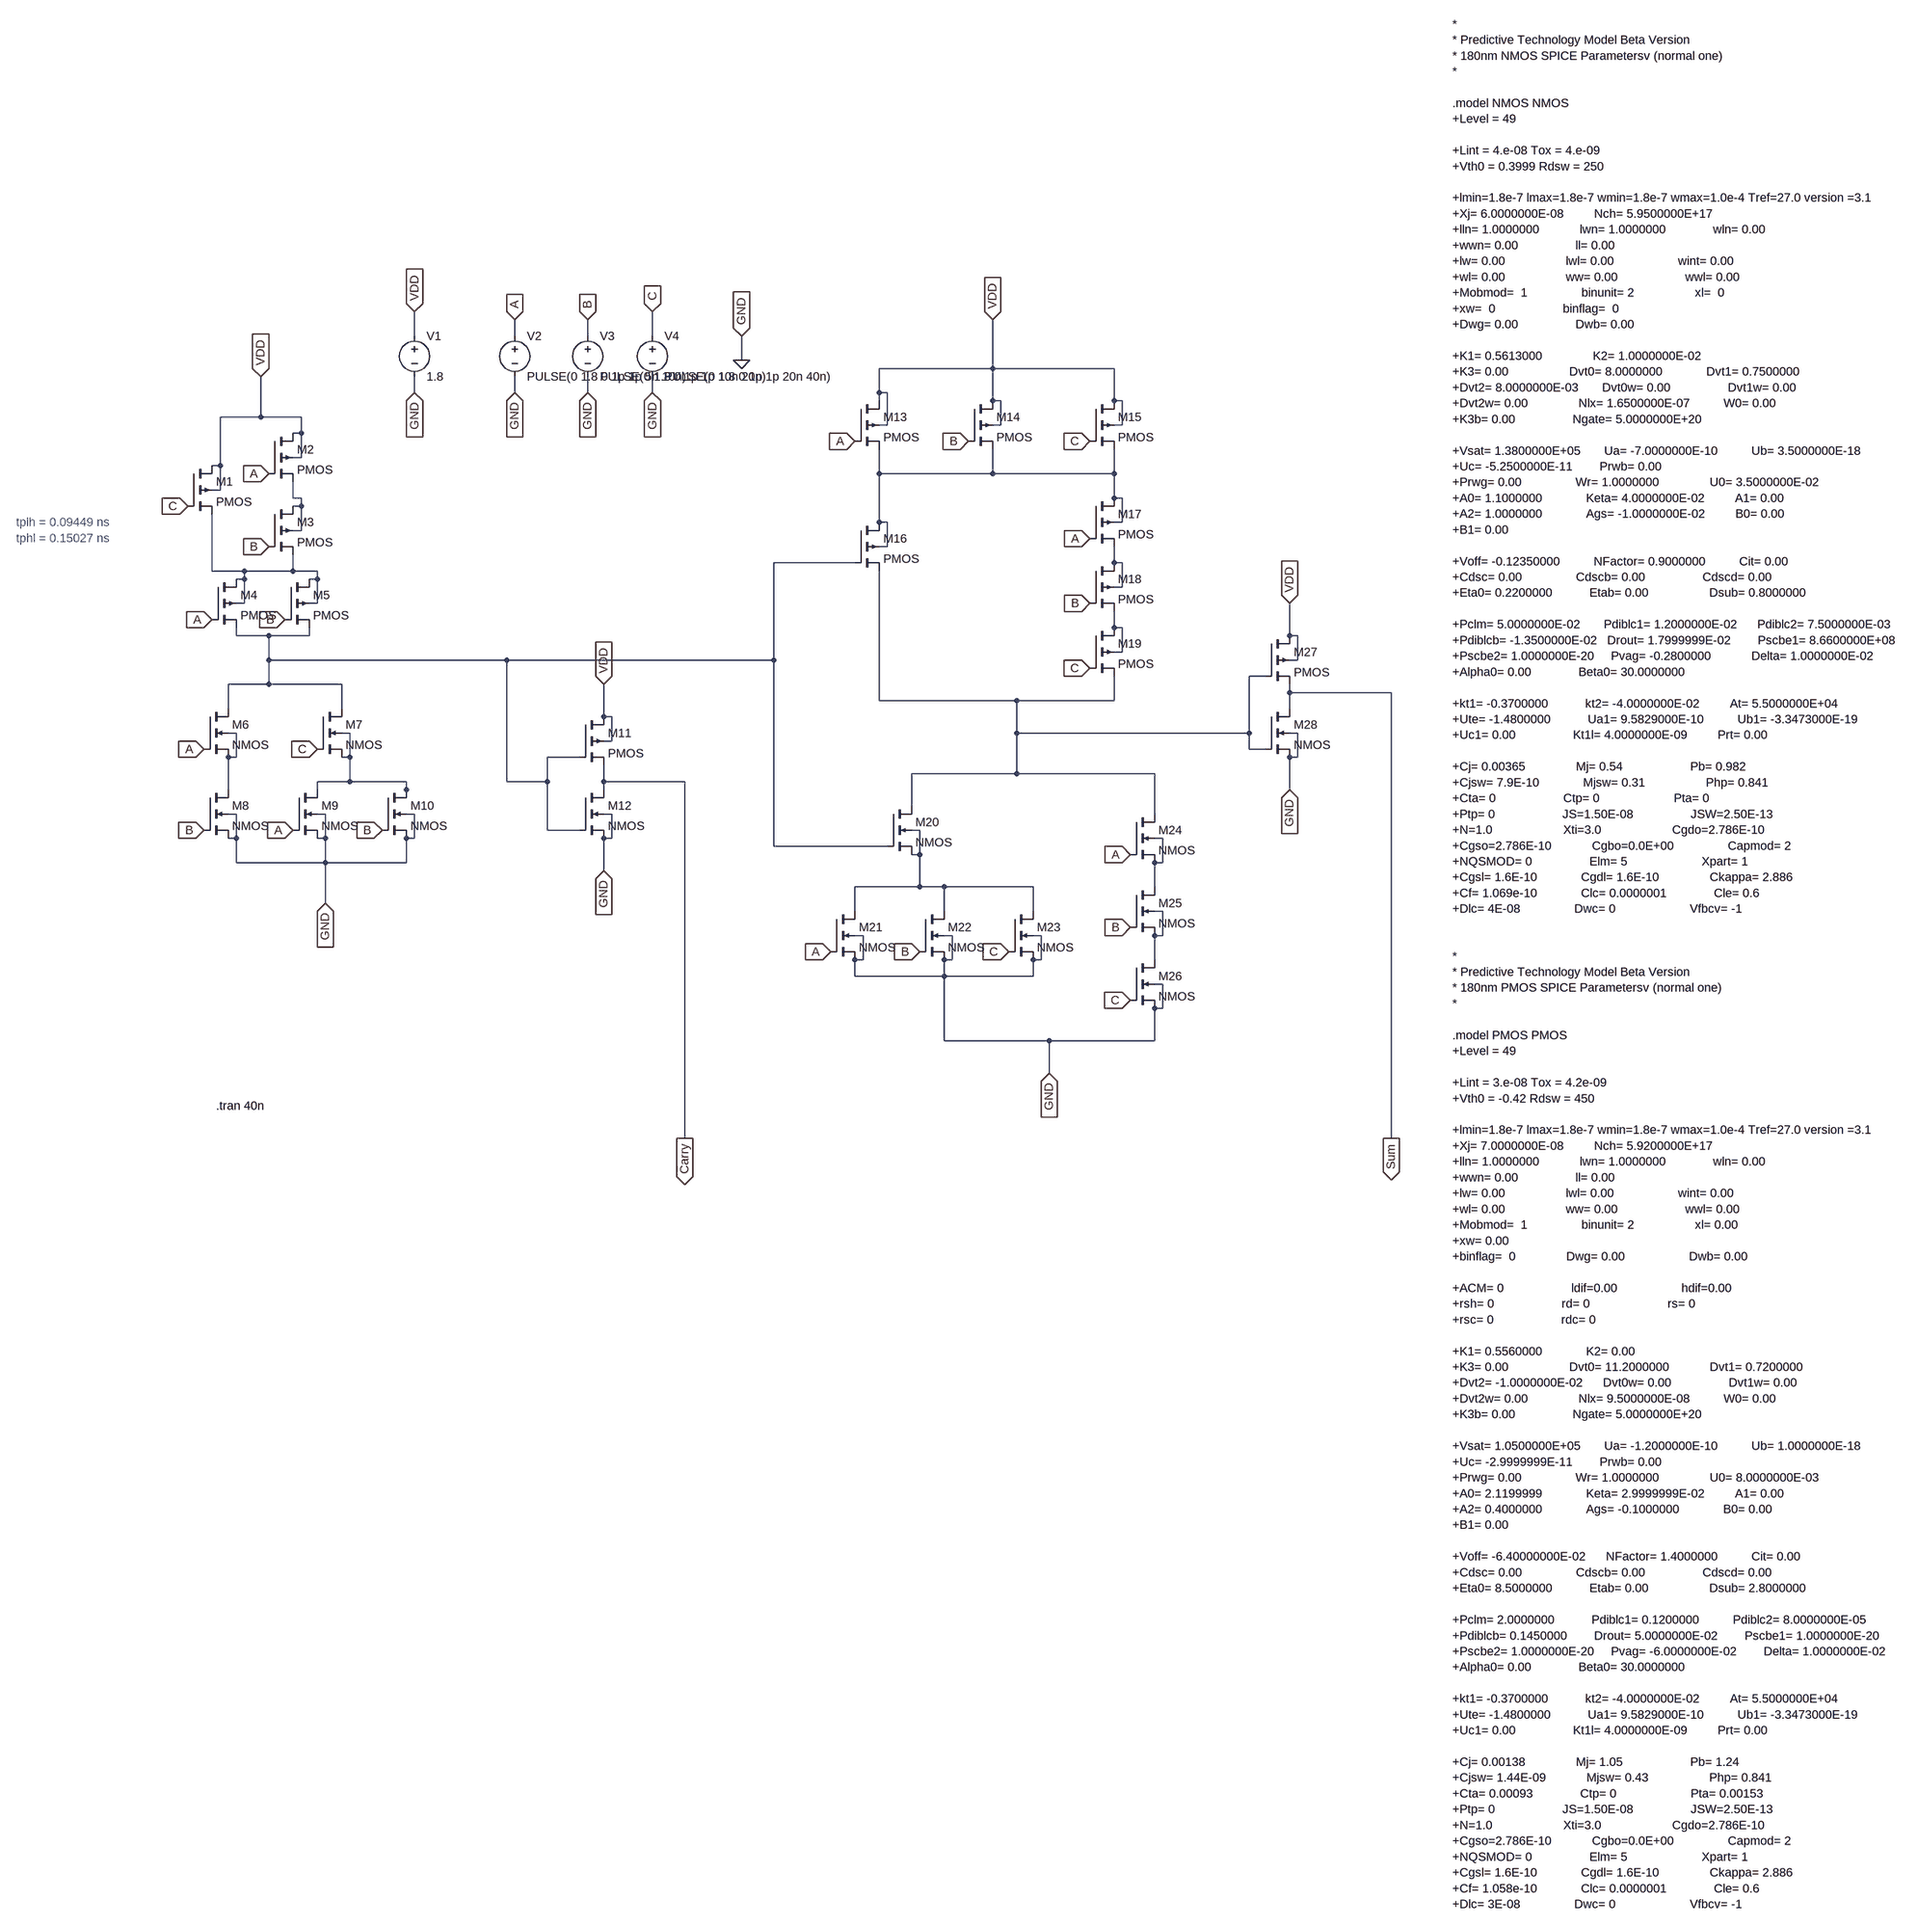
[diagram p0: schematic AssignmentCMOS.asc]
AssignmentCMOS.asc, the LTspice schematic file:
Version 4
SHEET 1 3944 2892
WIRE 512 -176 512 -224
WIRE 720 -176 720 -208
WIRE 864 -176 864 -208
WIRE 992 -176 992 -224
WIRE 1168 -128 1168 -176
WIRE 1664 -112 1664 -208
WIRE 1664 -112 1440 -112
WIRE 1904 -112 1664 -112
WIRE 512 -64 512 -96
WIRE 720 -64 720 -96
WIRE 864 -64 864 -96
WIRE 992 -64 992 -96
WIRE 1440 -64 1440 -112
WIRE 1456 -64 1440 -64
WIRE 1440 -48 1440 -64
WIRE 1664 -48 1664 -112
WIRE 1680 -48 1664 -48
WIRE 1904 -48 1904 -112
WIRE 1920 -48 1904 -48
WIRE 208 -16 208 -96
WIRE 208 -16 128 -16
WIRE 288 -16 208 -16
WIRE 1456 0 1456 -64
WIRE 1456 0 1440 0
WIRE 1680 0 1680 -48
WIRE 1680 0 1664 0
WIRE 1920 0 1920 -48
WIRE 1920 0 1904 0
WIRE 288 16 288 -16
WIRE 288 16 272 16
WIRE 288 64 288 16
WIRE 288 64 272 64
WIRE 128 80 128 -16
WIRE 128 80 112 80
WIRE 1440 96 1440 48
WIRE 1664 96 1664 48
WIRE 1664 96 1440 96
WIRE 1904 96 1904 48
WIRE 1904 96 1664 96
WIRE 128 128 128 80
WIRE 128 128 112 128
WIRE 272 144 272 112
WIRE 288 144 272 144
WIRE 1904 144 1904 96
WIRE 1920 144 1904 144
WIRE 288 160 288 144
WIRE 288 160 272 160
WIRE 1440 192 1440 96
WIRE 1456 192 1440 192
WIRE 1920 192 1920 144
WIRE 1920 192 1904 192
WIRE 288 208 288 160
WIRE 288 208 272 208
WIRE 1456 240 1456 192
WIRE 1456 240 1440 240
WIRE 1392 272 1232 272
WIRE 1904 272 1904 240
WIRE 1920 272 1904 272
WIRE 112 288 112 176
WIRE 176 288 112 288
WIRE 272 288 272 256
WIRE 272 288 176 288
WIRE 320 288 272 288
WIRE 176 304 176 288
WIRE 176 304 160 304
WIRE 320 304 320 288
WIRE 320 304 304 304
WIRE 1920 320 1920 272
WIRE 1920 320 1904 320
WIRE 176 352 176 304
WIRE 176 352 160 352
WIRE 320 352 320 304
WIRE 320 352 304 352
WIRE 1904 400 1904 368
WIRE 1920 400 1904 400
WIRE 160 416 160 400
WIRE 224 416 160 416
WIRE 304 416 304 400
WIRE 304 416 224 416
WIRE 2496 416 2496 352
WIRE 2512 416 2496 416
WIRE 1920 448 1920 400
WIRE 1920 448 1904 448
WIRE 224 464 224 416
WIRE 704 464 224 464
WIRE 1232 464 1232 272
WIRE 1232 464 704 464
WIRE 2512 464 2512 416
WIRE 2512 464 2496 464
WIRE 2448 496 2416 496
WIRE 224 512 224 464
WIRE 224 512 144 512
WIRE 368 512 224 512
WIRE 2496 528 2496 512
WIRE 2800 528 2496 528
WIRE 1440 544 1440 288
WIRE 1712 544 1440 544
WIRE 1904 544 1904 496
WIRE 1904 544 1712 544
WIRE 144 560 144 512
WIRE 368 560 368 512
WIRE 2496 560 2496 528
WIRE 896 576 896 512
WIRE 912 576 896 576
WIRE 160 608 144 608
WIRE 384 608 368 608
WIRE 1712 608 1712 544
WIRE 2416 608 2416 496
WIRE 2416 608 1712 608
WIRE 2512 608 2496 608
WIRE 912 624 912 576
WIRE 912 624 896 624
WIRE 2416 640 2416 608
WIRE 2448 640 2416 640
WIRE 160 656 160 608
WIRE 160 656 144 656
WIRE 384 656 384 608
WIRE 384 656 368 656
WIRE 848 656 784 656
WIRE 2512 656 2512 608
WIRE 2512 656 2496 656
WIRE 1712 688 1712 608
WIRE 1712 688 1504 688
WIRE 1984 688 1712 688
WIRE 384 704 384 656
WIRE 384 704 320 704
WIRE 496 704 384 704
WIRE 704 704 704 464
WIRE 784 704 784 656
WIRE 784 704 704 704
WIRE 896 704 896 672
WIRE 1056 704 896 704
WIRE 144 720 144 656
WIRE 320 720 320 704
WIRE 496 720 496 704
WIRE 896 720 896 704
WIRE 2496 720 2496 656
WIRE 496 736 496 720
WIRE 1504 752 1504 688
WIRE 160 768 144 768
WIRE 336 768 320 768
WIRE 512 768 496 768
WIRE 912 768 896 768
WIRE 1984 768 1984 688
WIRE 784 800 784 704
WIRE 848 800 784 800
WIRE 1520 800 1504 800
WIRE 160 816 160 768
WIRE 160 816 144 816
WIRE 336 816 336 768
WIRE 336 816 320 816
WIRE 512 816 512 768
WIRE 512 816 496 816
WIRE 912 816 912 768
WIRE 912 816 896 816
WIRE 2000 816 1984 816
WIRE 1232 832 1232 464
WIRE 1456 832 1232 832
WIRE 1520 848 1520 800
WIRE 1520 848 1504 848
WIRE 160 864 160 816
WIRE 336 864 336 816
WIRE 336 864 160 864
WIRE 496 864 496 816
WIRE 496 864 336 864
WIRE 2000 864 2000 816
WIRE 2000 864 1984 864
WIRE 896 880 896 816
WIRE 1520 912 1520 848
WIRE 1520 912 1392 912
WIRE 1568 912 1520 912
WIRE 1744 912 1568 912
WIRE 1984 912 1984 864
WIRE 336 944 336 864
WIRE 1392 960 1392 912
WIRE 1568 960 1568 912
WIRE 1744 960 1744 912
WIRE 2000 960 1984 960
WIRE 1408 1008 1392 1008
WIRE 1584 1008 1568 1008
WIRE 1760 1008 1744 1008
WIRE 2000 1008 2000 960
WIRE 2000 1008 1984 1008
WIRE 1408 1056 1408 1008
WIRE 1408 1056 1392 1056
WIRE 1584 1056 1584 1008
WIRE 1584 1056 1568 1056
WIRE 1760 1056 1760 1008
WIRE 1760 1056 1744 1056
WIRE 1984 1056 1984 1008
WIRE 1392 1088 1392 1056
WIRE 1568 1088 1568 1056
WIRE 1568 1088 1392 1088
WIRE 1744 1088 1744 1056
WIRE 1744 1088 1568 1088
WIRE 2000 1104 1984 1104
WIRE 2000 1152 2000 1104
WIRE 2000 1152 1984 1152
WIRE 1568 1216 1568 1088
WIRE 1776 1216 1568 1216
WIRE 1984 1216 1984 1152
WIRE 1984 1216 1776 1216
WIRE 1776 1280 1776 1216
WIRE 1056 1408 1056 704
WIRE 2800 1408 2800 528
FLAG 1168 -128 0
FLAG 1168 -176 GND
IOPIN 1168 -176 In
FLAG 992 -64 GND
IOPIN 992 -64 In
FLAG 720 -64 GND
IOPIN 720 -64 In
FLAG 512 -64 GND
IOPIN 512 -64 In
FLAG 864 -64 GND
IOPIN 864 -64 In
FLAG 512 -224 VDD
IOPIN 512 -224 In
FLAG 720 -208 A
IOPIN 720 -208 In
FLAG 864 -208 B
IOPIN 864 -208 In
FLAG 992 -224 C
IOPIN 992 -224 In
FLAG 208 -96 VDD
IOPIN 208 -96 In
FLAG 1664 -208 VDD
IOPIN 1664 -208 In
FLAG 896 512 VDD
IOPIN 896 512 In
FLAG 2496 352 VDD
IOPIN 2496 352 In
FLAG 336 944 GND
IOPIN 336 944 In
FLAG 896 880 GND
IOPIN 896 880 In
FLAG 1776 1280 GND
IOPIN 1776 1280 In
FLAG 2496 720 GND
IOPIN 2496 720 In
FLAG 2800 1408 Sum
IOPIN 2800 1408 Out
FLAG 1056 1408 Carry
IOPIN 1056 1408 Out
FLAG 64 160 C
IOPIN 64 160 In
FLAG 320 640 C
IOPIN 320 640 In
FLAG 1856 32 C
IOPIN 1856 32 In
FLAG 1856 480 C
IOPIN 1856 480 In
FLAG 1696 1040 C
IOPIN 1696 1040 In
FLAG 1936 1136 C
IOPIN 1936 1136 In
FLAG 224 96 A
IOPIN 224 96 In
FLAG 112 384 A
IOPIN 112 384 In
FLAG 96 640 A
IOPIN 96 640 In
FLAG 272 800 A
IOPIN 272 800 In
FLAG 1392 32 A
IOPIN 1392 32 In
FLAG 1856 224 A
IOPIN 1856 224 In
FLAG 1344 1040 A
IOPIN 1344 1040 In
FLAG 1936 848 A
IOPIN 1936 848 In
FLAG 224 240 B
IOPIN 224 240 In
FLAG 256 384 B
IOPIN 256 384 In
FLAG 96 800 B
IOPIN 96 800 In
FLAG 448 800 B
IOPIN 448 800 In
FLAG 1616 32 B
IOPIN 1616 32 In
FLAG 1856 352 B
IOPIN 1856 352 In
FLAG 1520 1040 B
IOPIN 1520 1040 In
FLAG 1936 992 B
IOPIN 1936 992 In
SYMBOL pmos4 64 80 R0
SYMATTR InstName M1
SYMATTR Value2 l=180n w=1440n
SYMBOL pmos4 224 16 R0
SYMATTR InstName M2
SYMATTR Value2 l=180n w=2880n
SYMBOL pmos4 224 160 R0
SYMATTR InstName M3
SYMATTR Value2 l=180n w=2880n
SYMBOL pmos4 112 304 R0
SYMATTR InstName M4
SYMATTR Value2 l=180n w=1440n
SYMBOL pmos4 256 304 R0
SYMATTR InstName M5
SYMATTR Value2 l=180n w=1440n
SYMBOL nmos4 96 560 R0
SYMATTR InstName M6
SYMATTR Value2 l=180n w=360n
SYMBOL nmos4 320 560 R0
SYMATTR InstName M7
SYMATTR Value2 l=180n w=360n
SYMBOL nmos4 96 720 R0
SYMATTR InstName M8
SYMATTR Value2 l=180n w=360n
SYMBOL nmos4 272 720 R0
SYMATTR InstName M9
SYMATTR Value2 l=180n w=360n
SYMBOL nmos4 448 720 R0
SYMATTR InstName M10
SYMATTR Value2 l=180n w=360n
SYMBOL pmos4 848 576 R0
SYMATTR InstName M11
SYMATTR Value2 l=180n w=720n
SYMBOL nmos4 848 720 R0
SYMATTR InstName M12
SYMATTR Value2 l=180n w=180n
SYMBOL pmos4 1392 -48 R0
SYMATTR InstName M13
SYMATTR Value2 l=180n w=1440n
SYMBOL pmos4 1616 -48 R0
SYMATTR InstName M14
SYMATTR Value2 l=180n w=1440n
SYMBOL pmos4 1856 -48 R0
SYMATTR InstName M15
SYMATTR Value2 l=180n w=1440n
SYMBOL pmos4 1392 192 R0
SYMATTR InstName M16
SYMATTR Value2 l=180n w=1440n
SYMBOL pmos4 1856 144 R0
SYMATTR InstName M17
SYMATTR Value2 l=180n w=4320n
SYMBOL pmos4 1856 272 R0
SYMATTR InstName M18
SYMATTR Value2 l=180n w=4320n
SYMBOL pmos4 1856 400 R0
SYMATTR InstName M19
SYMATTR Value2 l=180n w=4320n
SYMBOL nmos4 1456 752 R0
SYMATTR InstName M20
SYMATTR Value2 l=180n w=360n
SYMBOL nmos4 1344 960 R0
SYMATTR InstName M21
SYMATTR Value2 l=180n w=360n
SYMBOL nmos4 1520 960 R0
SYMATTR InstName M22
SYMATTR Value2 l=180n w=360n
SYMBOL nmos4 1696 960 R0
SYMATTR InstName M23
SYMATTR Value2 l=180n w=360n
SYMBOL nmos4 1936 768 R0
SYMATTR InstName M24
SYMATTR Value2 l=180n w=540n
SYMBOL nmos4 1936 912 R0
SYMATTR InstName M25
SYMATTR Value2 l=180n w=540n
SYMBOL nmos4 1936 1056 R0
SYMATTR InstName M26
SYMATTR Value2 l=180n w=540n
SYMBOL pmos4 2448 416 R0
SYMATTR InstName M27
SYMATTR Value2 l=180n w=720n
SYMBOL nmos4 2448 560 R0
SYMATTR InstName M28
SYMATTR Value2 l=180n w=180n
SYMBOL voltage 512 -192 R0
WINDOW 123 0 0 Left 0
WINDOW 39 0 0 Left 0
SYMATTR InstName V1
SYMATTR Value 1.8
SYMBOL voltage 720 -192 R0
WINDOW 123 0 0 Left 0
WINDOW 39 0 0 Left 0
SYMATTR InstName V2
SYMATTR Value PULSE(0 1.8 0 1p 1p 5n 10n)
SYMBOL voltage 864 -192 R0
WINDOW 123 0 0 Left 0
WINDOW 39 0 0 Left 0
SYMATTR InstName V3
SYMATTR Value PULSE(0 1.8 0 1p 1p 10n 20n)
SYMBOL voltage 992 -192 R0
WINDOW 123 0 0 Left 0
WINDOW 39 0 0 Left 0
SYMATTR InstName V4
SYMATTR Value PULSE(0 1.8 0 1p 1p 20n 40n)
TEXT 2976 -792 Left 2 !*\n* Predictive Technology Model Beta Version\n* 180nm NMOS SPICE Parametersv (normal one)\n*\n \n.model NMOS NMOS\n+Level = 49\n \n+Lint = 4.e-08 Tox = 4.e-09 \n+Vth0 = 0.3999 Rdsw = 250 \n \n+lmin=1.8e-7 lmax=1.8e-7 wmin=1.8e-7 wmax=1.0e-4 Tref=27.0 version =3.1\n+Xj= 6.0000000E-08         Nch= 5.9500000E+17 \n+lln= 1.0000000            lwn= 1.0000000              wln= 0.00\n+wwn= 0.00                 ll= 0.00\n+lw= 0.00                  lwl= 0.00                   wint= 0.00\n+wl= 0.00                  ww= 0.00                    wwl= 0.00\n+Mobmod=  1                binunit= 2                  xl=  0\n+xw=  0                    binflag=  0\n+Dwg= 0.00                 Dwb= 0.00 \n \n+K1= 0.5613000               K2= 1.0000000E-02 \n+K3= 0.00                  Dvt0= 8.0000000             Dvt1= 0.7500000 \n+Dvt2= 8.0000000E-03       Dvt0w= 0.00                 Dvt1w= 0.00 \n+Dvt2w= 0.00               Nlx= 1.6500000E-07          W0= 0.00 \n+K3b= 0.00                 Ngate= 5.0000000E+20 \n \n+Vsat= 1.3800000E+05       Ua= -7.0000000E-10          Ub= 3.5000000E-18 \n+Uc= -5.2500000E-11        Prwb= 0.00 \n+Prwg= 0.00                Wr= 1.0000000               U0= 3.5000000E-02 \n+A0= 1.1000000             Keta= 4.0000000E-02         A1= 0.00 \n+A2= 1.0000000             Ags= -1.0000000E-02         B0= 0.00 \n+B1= 0.00 \n \n+Voff= -0.12350000          NFactor= 0.9000000          Cit= 0.00 \n+Cdsc= 0.00                Cdscb= 0.00                 Cdscd= 0.00 \n+Eta0= 0.2200000           Etab= 0.00                  Dsub= 0.8000000 \n \n+Pclm= 5.0000000E-02       Pdiblc1= 1.2000000E-02      Pdiblc2= 7.5000000E-03 \n+Pdiblcb= -1.3500000E-02   Drout= 1.7999999E-02        Pscbe1= 8.6600000E+08 \n+Pscbe2= 1.0000000E-20     Pvag= -0.2800000            Delta= 1.0000000E-02 \n+Alpha0= 0.00              Beta0= 30.0000000 \n \n+kt1= -0.3700000           kt2= -4.0000000E-02         At= 5.5000000E+04 \n+Ute= -1.4800000           Ua1= 9.5829000E-10          Ub1= -3.3473000E-19 \n+Uc1= 0.00                 Kt1l= 4.0000000E-09         Prt= 0.00 \n \n+Cj= 0.00365               Mj= 0.54                    Pb= 0.982\n+Cjsw= 7.9E-10             Mjsw= 0.31                  Php= 0.841\n+Cta= 0                    Ctp= 0                      Pta= 0\n+Ptp= 0                    JS=1.50E-08                 JSW=2.50E-13\n+N=1.0                     Xti=3.0                     Cgdo=2.786E-10\n+Cgso=2.786E-10            Cgbo=0.0E+00                Capmod= 2\n+NQSMOD= 0                 Elm= 5                      Xpart= 1\n+Cgsl= 1.6E-10             Cgdl= 1.6E-10               Ckappa= 2.886\n+Cf= 1.069e-10             Clc= 0.0000001              Cle= 0.6\n+Dlc= 4E-08                Dwc= 0                      Vfbcv= -1\n \n \n*\n* Predictive Technology Model Beta Version\n* 180nm PMOS SPICE Parametersv (normal one)\n*\n \n.model PMOS PMOS\n+Level = 49\n \n+Lint = 3.e-08 Tox = 4.2e-09 \n+Vth0 = -0.42 Rdsw = 450 \n \n+lmin=1.8e-7 lmax=1.8e-7 wmin=1.8e-7 wmax=1.0e-4 Tref=27.0 version =3.1\n+Xj= 7.0000000E-08         Nch= 5.9200000E+17 \n+lln= 1.0000000            lwn= 1.0000000              wln= 0.00\n+wwn= 0.00                 ll= 0.00\n+lw= 0.00                  lwl= 0.00                   wint= 0.00\n+wl= 0.00                  ww= 0.00                    wwl= 0.00\n+Mobmod=  1                binunit= 2                  xl= 0.00\n+xw= 0.00                  \n+binflag=  0               Dwg= 0.00                   Dwb= 0.00 \n \n+ACM= 0                    ldif=0.00                   hdif=0.00\n+rsh= 0                    rd= 0                       rs= 0\n+rsc= 0                    rdc= 0\n \n+K1= 0.5560000             K2= 0.00 \n+K3= 0.00                  Dvt0= 11.2000000            Dvt1= 0.7200000 \n+Dvt2= -1.0000000E-02      Dvt0w= 0.00                 Dvt1w= 0.00 \n+Dvt2w= 0.00               Nlx= 9.5000000E-08          W0= 0.00 \n+K3b= 0.00                 Ngate= 5.0000000E+20 \n \n+Vsat= 1.0500000E+05       Ua= -1.2000000E-10          Ub= 1.0000000E-18 \n+Uc= -2.9999999E-11        Prwb= 0.00 \n+Prwg= 0.00                Wr= 1.0000000               U0= 8.0000000E-03 \n+A0= 2.1199999             Keta= 2.9999999E-02         A1= 0.00 \n+A2= 0.4000000             Ags= -0.1000000             B0= 0.00 \n+B1= 0.00 \n \n+Voff= -6.40000000E-02      NFactor= 1.4000000          Cit= 0.00 \n+Cdsc= 0.00                Cdscb= 0.00                 Cdscd= 0.00 \n+Eta0= 8.5000000           Etab= 0.00                  Dsub= 2.8000000 \n \n+Pclm= 2.0000000           Pdiblc1= 0.1200000          Pdiblc2= 8.0000000E-05 \n+Pdiblcb= 0.1450000        Drout= 5.0000000E-02        Pscbe1= 1.0000000E-20 \n+Pscbe2= 1.0000000E-20     Pvag= -6.0000000E-02        Delta= 1.0000000E-02 \n+Alpha0= 0.00              Beta0= 30.0000000 \n \n+kt1= -0.3700000           kt2= -4.0000000E-02         At= 5.5000000E+04 \n+Ute= -1.4800000           Ua1= 9.5829000E-10          Ub1= -3.3473000E-19 \n+Uc1= 0.00                 Kt1l= 4.0000000E-09         Prt= 0.00 \n \n+Cj= 0.00138               Mj= 1.05                    Pb= 1.24\n+Cjsw= 1.44E-09            Mjsw= 0.43                  Php= 0.841\n+Cta= 0.00093              Ctp= 0                      Pta= 0.00153\n+Ptp= 0                    JS=1.50E-08                 JSW=2.50E-13\n+N=1.0                     Xti=3.0                     Cgdo=2.786E-10\n+Cgso=2.786E-10            Cgbo=0.0E+00                Capmod= 2\n+NQSMOD= 0                 Elm= 5                      Xpart= 1\n+Cgsl= 1.6E-10             Cgdl= 1.6E-10               Ckappa= 2.886\n+Cf= 1.058e-10             Clc= 0.0000001              Cle= 0.6\n+Dlc= 3E-08                Dwc= 0                      Vfbcv= -1
TEXT 120 1344 Left 2 !.tran 40n
TEXT -440 192 Left 2 ;tplh = 0.09449 ns\ntphl = 0.15027 ns

The netlist it stands for:
* AssignmentCMOS.asc
M1 VDD C N005 VDD PMOS l=180n w=1440n
M2 VDD A N002 VDD PMOS l=180n w=2880n
M3 N002 B N005 N002 PMOS l=180n w=2880n
M4 N005 A N003 N005 PMOS l=180n w=1440n
M5 N005 B N003 N005 PMOS l=180n w=1440n
M6 N003 A N008 N008 NMOS l=180n w=360n
M7 N003 C N009 N009 NMOS l=180n w=360n
M8 N008 B 0 0 NMOS l=180n w=360n
M9 N009 A 0 0 NMOS l=180n w=360n
M10 N009 B 0 0 NMOS l=180n w=360n
M11 VDD N003 Carry VDD PMOS l=180n w=720n
M12 Carry N003 0 0 NMOS l=180n w=180n
M13 VDD A N001 VDD PMOS l=180n w=1440n
M14 VDD B N001 VDD PMOS l=180n w=1440n
M15 VDD C N001 VDD PMOS l=180n w=1440n
M16 N001 N003 N007 N001 PMOS l=180n w=1440n
M17 N001 A N004 N001 PMOS l=180n w=4320n
M18 N004 B N006 N004 PMOS l=180n w=4320n
M19 N006 C N007 N006 PMOS l=180n w=4320n
M20 N007 N003 N010 N010 NMOS l=180n w=360n
M21 N010 A 0 0 NMOS l=180n w=360n
M22 N010 B 0 0 NMOS l=180n w=360n
M23 N010 C 0 0 NMOS l=180n w=360n
M24 N007 A N011 N011 NMOS l=180n w=540n
M25 N011 B N012 N012 NMOS l=180n w=540n
M26 N012 C 0 0 NMOS l=180n w=540n
M27 VDD N007 Sum VDD PMOS l=180n w=720n
M28 Sum N007 0 0 NMOS l=180n w=180n
V1 VDD 0 1.8
V2 A 0 PULSE(0 1.8 0 1p 1p 5n 10n)
V3 B 0 PULSE(0 1.8 0 1p 1p 10n 20n)
V4 C 0 PULSE(0 1.8 0 1p 1p 20n 40n)
.model NMOS NMOS
.model PMOS PMOS
.lib standard.mos
*
* Predictive Technology Model Beta Version
* 180nm NMOS SPICE Parametersv (normal one)
*
.model NMOS NMOS
+Level = 49
+Lint = 4.e-08 Tox = 4.e-09
+Vth0 = 0.3999 Rdsw = 250
+lmin=1.8e-7 lmax=1.8e-7 wmin=1.8e-7 wmax=1.0e-4 Tref=27.0 version =3.1
+Xj= 6.0000000E-08         Nch= 5.9500000E+17
+lln= 1.0000000            lwn= 1.0000000              wln= 0.00
+wwn= 0.00                 ll= 0.00
+lw= 0.00                  lwl= 0.00                   wint= 0.00
+wl= 0.00                  ww= 0.00                    wwl= 0.00
+Mobmod=  1                binunit= 2                  xl=  0
+xw=  0                    binflag=  0
+Dwg= 0.00                 Dwb= 0.00
+K1= 0.5613000               K2= 1.0000000E-02
+K3= 0.00                  Dvt0= 8.0000000             Dvt1= 0.7500000
+Dvt2= 8.0000000E-03       Dvt0w= 0.00                 Dvt1w= 0.00
+Dvt2w= 0.00               Nlx= 1.6500000E-07          W0= 0.00
+K3b= 0.00                 Ngate= 5.0000000E+20
+Vsat= 1.3800000E+05       Ua= -7.0000000E-10          Ub= 3.5000000E-18
+Uc= -5.2500000E-11        Prwb= 0.00
+Prwg= 0.00                Wr= 1.0000000               U0= 3.5000000E-02
+A0= 1.1000000             Keta= 4.0000000E-02         A1= 0.00
+A2= 1.0000000             Ags= -1.0000000E-02         B0= 0.00
+B1= 0.00
+Voff= -0.12350000          NFactor= 0.9000000          Cit= 0.00
+Cdsc= 0.00                Cdscb= 0.00                 Cdscd= 0.00
+Eta0= 0.2200000           Etab= 0.00                  Dsub= 0.8000000
+Pclm= 5.0000000E-02       Pdiblc1= 1.2000000E-02      Pdiblc2= 7.5000000E-03
+Pdiblcb= -1.3500000E-02   Drout= 1.7999999E-02        Pscbe1= 8.6600000E+08
+Pscbe2= 1.0000000E-20     Pvag= -0.2800000            Delta= 1.0000000E-02
+Alpha0= 0.00              Beta0= 30.0000000
+kt1= -0.3700000           kt2= -4.0000000E-02         At= 5.5000000E+04
+Ute= -1.4800000           Ua1= 9.5829000E-10          Ub1= -3.3473000E-19
+Uc1= 0.00                 Kt1l= 4.0000000E-09         Prt= 0.00
+Cj= 0.00365               Mj= 0.54                    Pb= 0.982
+Cjsw= 7.9E-10             Mjsw= 0.31                  Php= 0.841
+Cta= 0                    Ctp= 0                      Pta= 0
+Ptp= 0                    JS=1.50E-08                 JSW=2.50E-13
+N=1.0                     Xti=3.0                     Cgdo=2.786E-10
+Cgso=2.786E-10            Cgbo=0.0E+00                Capmod= 2
+NQSMOD= 0                 Elm= 5                      Xpart= 1
+Cgsl= 1.6E-10             Cgdl= 1.6E-10               Ckappa= 2.886
+Cf= 1.069e-10             Clc= 0.0000001              Cle= 0.6
+Dlc= 4E-08                Dwc= 0                      Vfbcv= -1
*
* Predictive Technology Model Beta Version
* 180nm PMOS SPICE Parametersv (normal one)
*
.model PMOS PMOS
+Level = 49
+Lint = 3.e-08 Tox = 4.2e-09
+Vth0 = -0.42 Rdsw = 450
+lmin=1.8e-7 lmax=1.8e-7 wmin=1.8e-7 wmax=1.0e-4 Tref=27.0 version =3.1
+Xj= 7.0000000E-08         Nch= 5.9200000E+17
+lln= 1.0000000            lwn= 1.0000000              wln= 0.00
+wwn= 0.00                 ll= 0.00
+lw= 0.00                  lwl= 0.00                   wint= 0.00
+wl= 0.00                  ww= 0.00                    wwl= 0.00
+Mobmod=  1                binunit= 2                  xl= 0.00
+xw= 0.00
+binflag=  0               Dwg= 0.00                   Dwb= 0.00
+ACM= 0                    ldif=0.00                   hdif=0.00
+rsh= 0                    rd= 0                       rs= 0
+rsc= 0                    rdc= 0
+K1= 0.5560000             K2= 0.00
+K3= 0.00                  Dvt0= 11.2000000            Dvt1= 0.7200000
+Dvt2= -1.0000000E-02      Dvt0w= 0.00                 Dvt1w= 0.00
+Dvt2w= 0.00               Nlx= 9.5000000E-08          W0= 0.00
+K3b= 0.00                 Ngate= 5.0000000E+20
+Vsat= 1.0500000E+05       Ua= -1.2000000E-10          Ub= 1.0000000E-18
+Uc= -2.9999999E-11        Prwb= 0.00
+Prwg= 0.00                Wr= 1.0000000               U0= 8.0000000E-03
+A0= 2.1199999             Keta= 2.9999999E-02         A1= 0.00
+A2= 0.4000000             Ags= -0.1000000             B0= 0.00
+B1= 0.00
+Voff= -6.40000000E-02      NFactor= 1.4000000          Cit= 0.00
+Cdsc= 0.00                Cdscb= 0.00                 Cdscd= 0.00
+Eta0= 8.5000000           Etab= 0.00                  Dsub= 2.8000000
+Pclm= 2.0000000           Pdiblc1= 0.1200000          Pdiblc2= 8.0000000E-05
+Pdiblcb= 0.1450000        Drout= 5.0000000E-02        Pscbe1= 1.0000000E-20
+Pscbe2= 1.0000000E-20     Pvag= -6.0000000E-02        Delta= 1.0000000E-02
+Alpha0= 0.00              Beta0= 30.0000000
+kt1= -0.3700000           kt2= -4.0000000E-02         At= 5.5000000E+04
+Ute= -1.4800000           Ua1= 9.5829000E-10          Ub1= -3.3473000E-19
+Uc1= 0.00                 Kt1l= 4.0000000E-09         Prt= 0.00
+Cj= 0.00138               Mj= 1.05                    Pb= 1.24
+Cjsw= 1.44E-09            Mjsw= 0.43                  Php= 0.841
+Cta= 0.00093              Ctp= 0                      Pta= 0.00153
+Ptp= 0                    JS=1.50E-08                 JSW=2.50E-13
+N=1.0                     Xti=3.0                     Cgdo=2.786E-10
+Cgso=2.786E-10            Cgbo=0.0E+00                Capmod= 2
+NQSMOD= 0                 Elm= 5                      Xpart= 1
+Cgsl= 1.6E-10             Cgdl= 1.6E-10               Ckappa= 2.886
+Cf= 1.058e-10             Clc= 0.0000001              Cle= 0.6
+Dlc= 3E-08                Dwc= 0                      Vfbcv= -1
.tran 40n
* tplh = 0.09449 ns
* tphl = 0.15027 ns
.backanno
.end